# Altium schematic sheet ATmega128 V1.0.SchDoc
size 177 x 127 mm
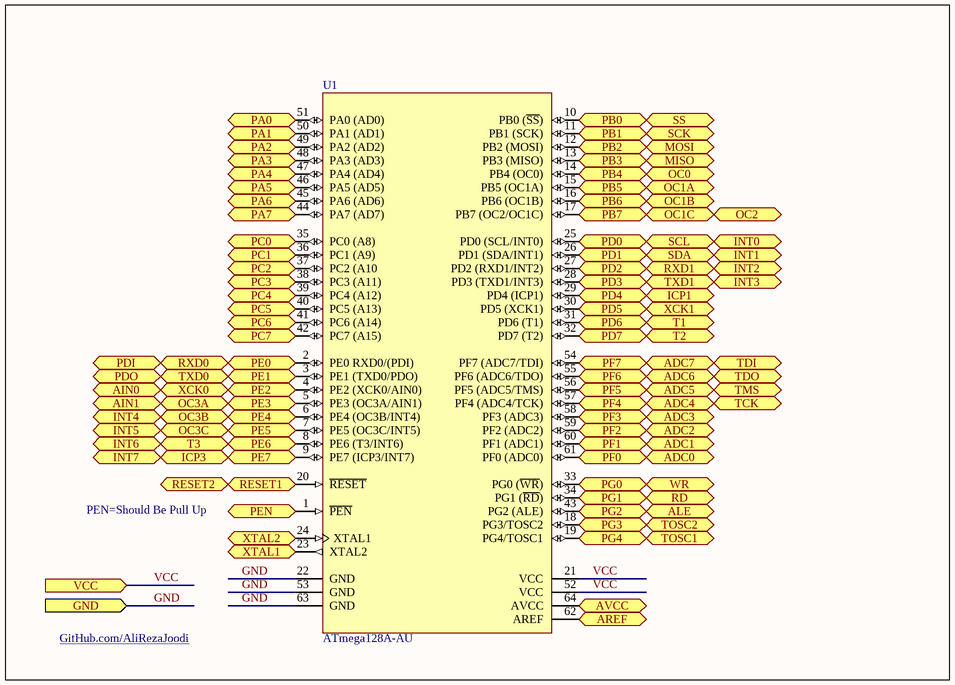
[diagram p0: ATmega128 V1.0.SchDoc]

## Parts
U1  ATmega128A-AU  [64A_M]

## Ports
ADC0 (bidir), ADC1 (bidir), ADC2 (bidir), ADC3 (bidir), ADC4 (bidir), ADC5 (bidir), ADC6 (bidir), ADC7 (bidir), AIN0, AIN1, ALE (bidir), AREF, AVCC, GND (in), ICP1 (bidir), ICP3 (bidir), INT0 (bidir), INT1 (bidir), INT2 (bidir), INT3 (bidir), INT4 (in), INT5 (in), INT6 (in), INT7 (in), MISO (bidir), MOSI (bidir), OC0 (bidir), OC1A (bidir), OC1B (bidir), OC1C (bidir), OC2 (bidir), OC3A (out), OC3B (out), OC3C (out), PA0 (bidir), PA1 (bidir), PA2 (bidir), PA3 (bidir), PA4 (bidir), PA5 (bidir), PA6 (bidir), PA7 (bidir), PB0, PB1, PB2, PB3, PB4, PB5, PB6, PB7, PC0 (bidir), PC1 (bidir), PC2 (bidir), PC3 (bidir), PC4 (bidir), PC5 (bidir), PC6 (bidir), PC7 (bidir), PD0, PD1, PD2, PD3, PD4, PD5, PD6, PD7, PDI (in), PDO (out), PE0, PE1, PE2, PE3, PE4, PE5, PE6, PE7, PEN (bidir), PF0, PF1, PF2, PF3, PF4, PF5, PF6, PF7, PG0, PG1, PG2, PG3, PG4, RD (bidir), RESET1, RESET2, RXD0 (bidir), RXD1 (bidir), SCK (bidir), SCL (bidir), SDA (bidir), SS (bidir), T1 (bidir), T2 (bidir), T3 (bidir), TCK (bidir), TDI (bidir), TDO (bidir), TMS (bidir), TOSC1 (bidir), TOSC2 (bidir), TXD0 (bidir), TXD1 (bidir), VCC (in), WR (bidir), XCK0, XCK1 (bidir), XTAL1, XTAL2

## Nets
ADC0: U1.61(PF0_(ADC0)) ; port ADC0, port PF0
ADC1: U1.60(PF1_(ADC1)) ; port ADC1, port PF1
ADC2: U1.59(PF2_(ADC2)) ; port ADC2, port PF2
ADC3: U1.58(PF3_(ADC3)) ; port ADC3, port PF3
ADC4: U1.57(PF4_(ADC4/TCK)) ; port ADC4, port PF4, port TCK
ADC5: U1.56(PF5_(ADC5/TMS)) ; port ADC5, port PF5, port TMS
ADC6: U1.55(PF6_(ADC6/TDO)) ; port ADC6, port PF6, port TDO
ADC7: U1.54(PF7_(ADC7/TDI)) ; port ADC7, port PF7, port TDI
AIN0: U1.4(PE2_(XCK0/AIN0)) ; port PE2, port XCK0, port AIN0
AIN1: U1.5(PE3_(OC3A/AIN1)) ; port PE3, port OC3A, port AIN1
ALE: U1.43(PG2_(ALE)) ; port PG2, port ALE
AREF: U1.62(AREF) ; port AREF
AVCC: U1.64(AVCC) ; port AVCC
GND: U1.22(GND) U1.53(GND) U1.63(GND) ; port GND
ICP1: U1.29(PD4_(ICP1)) ; port PD4, port ICP1
ICP3: U1.9(PE7_(ICP3/INT7)) ; port PE7, port ICP3, port INT7
INT0: U1.25(PD0_(SCL/INT0)) ; port PD0, port SCL, port INT0
INT1: U1.26(PD1_(SDA/INT1)) ; port PD1, port SDA, port INT1
INT2: U1.27(PD2_(RXD1/INT2)) ; port PD2, port RXD1, port INT2
INT3: U1.28(PD3_(TXD1/INT3)) ; port PD3, port TXD1, port INT3
INT4: U1.6(PE4_(OC3B/INT4)) ; port PE4, port OC3B, port INT4
INT5: U1.7(PE5_(OC3C/INT5)) ; port PE5, port OC3C, port INT5
INT6: U1.8(PE6_(T3/INT6)) ; port T3, port PE6, port INT6
MISO: U1.13(PB3_(MISO)) ; port PB3, port MISO
MOSI: U1.12(PB2_(MOSI)) ; port PB2, port MOSI
OC0: U1.14(PB4_(OC0)) ; port PB4, port OC0
OC1A: U1.15(PB5_(OC1A)) ; port PB5, port OC1A
OC1B: U1.16(PB6_(OC1B)) ; port PB6, port OC1B
OC1C: U1.17(PB7_(OC2/OC1C)) ; port PB7, port OC1C, port OC2
PA0: U1.51(PA0_(AD0)) ; port PA0
PA1: U1.50(PA1_(AD1)) ; port PA1
PA2: U1.49(PA2_(AD2)) ; port PA2
PA3: U1.48(PA3_(AD3)) ; port PA3
PA4: U1.47(PA4_(AD4)) ; port PA4
PA5: U1.46(PA5_(AD5)) ; port PA5
PA6: U1.45(PA6_(AD6)) ; port PA6
PA7: U1.44(PA7_(AD7)) ; port PA7
PB0: U1.10(PB0_(~{SS})) ; port PB0, port SS
PB1: U1.11(PB1_(SCK)) ; port PB1, port SCK
PC0: U1.35(PC0_(A8)) ; port PC0
PC1: U1.36(PC1_(A9)) ; port PC1
PC2: U1.37(PC2_(A10) ; port PC2
PC3: U1.38(PC3_(A11)) ; port PC3
PC4: U1.39(PC4_(A12)) ; port PC4
PC5: U1.40(PC5_(A13)) ; port PC5
PC6: U1.41(PC6_(A14)) ; port PC6
PC7: U1.42(PC7_(A15)) ; port PC7
PD5: U1.30(PD5_(XCK1)) ; port PD5, port XCK1
PD6: U1.31(PD6_(T1)) ; port PD6, port T1
PD7: U1.32(PD7_(T2)) ; port PD7, port T2
PDI: U1.2(PE0_RXD0/(PDI)) ; port PDI, port RXD0, port PE0
PDO: U1.3(PE1_(TXD0/PDO)) ; port TXD0, port PE1, port PDO
PEN: U1.1(~{PEN}) ; port PEN
PG0: U1.33(PG0_(~{WR})) ; port PG0, port WR
PG1: U1.34(PG1_(~{RD})) ; port PG1, port RD
PG3: U1.18(PG3/TOSC2) ; port PG3, port TOSC2
PG4: U1.19(PG4/TOSC1) ; port PG4, port TOSC1
RESET1: U1.20(~{RESET}) ; port RESET1, port RESET2
VCC: U1.21(VCC) U1.52(VCC) ; port VCC
XTAL1: U1.23(XTAL2) ; port XTAL1
XTAL2: U1.24(XTAL1) ; port XTAL2

## Notes on the sheet
- PEN=Should Be Pull Up
- GitHub.com/AliRezaJoodi

## Library data of the parts
U1 = ATmega128A-AU: 8-bit AVR Microcontroller, 128KB Flash, 4KB EEPROM, 4KB SRAM, 64-pin TQFP, Industrial Grade (-40°C to 85°C); Published: 1-Apr-2010; DatasheetVersion: revE, Feb-2010; PackageVersion: revB, Oct-2001; PackageReference: 64A; Publisher: Altium Limited; PackageDescription: 64-Pin Plastic Thin Profile Quad Flat Pack, 14 x 14 x 1.0 mm Body, 0.8 mm Pitch (TQFP); Supplier 1: Digi-Key; Supplier Part Number 1: ATMEGA128A-AU-ND; Supplier 2: Farnell; Supplier Part Number 2: 1773397; Supplier 3: Mouser; Supplier Part Number 3: 556-ATMEGA128A-AU; Code_JEDEC: MS-026-AEB; ComponentLink1Description: Manufacturer Link; ComponentLink1URL: http://www.atmel.com/products/avr/default.asp?; ComponentLink2Description: ATmega128A Datasheet; ComponentLink2URL: http://www.atmel.com/dyn/resources/prod_documents/doc8151.pdf; ComponentLink3Description: ATmega128A Summary; ComponentLink3URL: http://www.atmel.com/dyn/resources/prod_documents/8151S.pdf; ComponentLink4Description: Atmel.com Home; ComponentLink4URL: http://www.atmel.com